# EAGLE design spi_node (EAGLE 9.6.2)
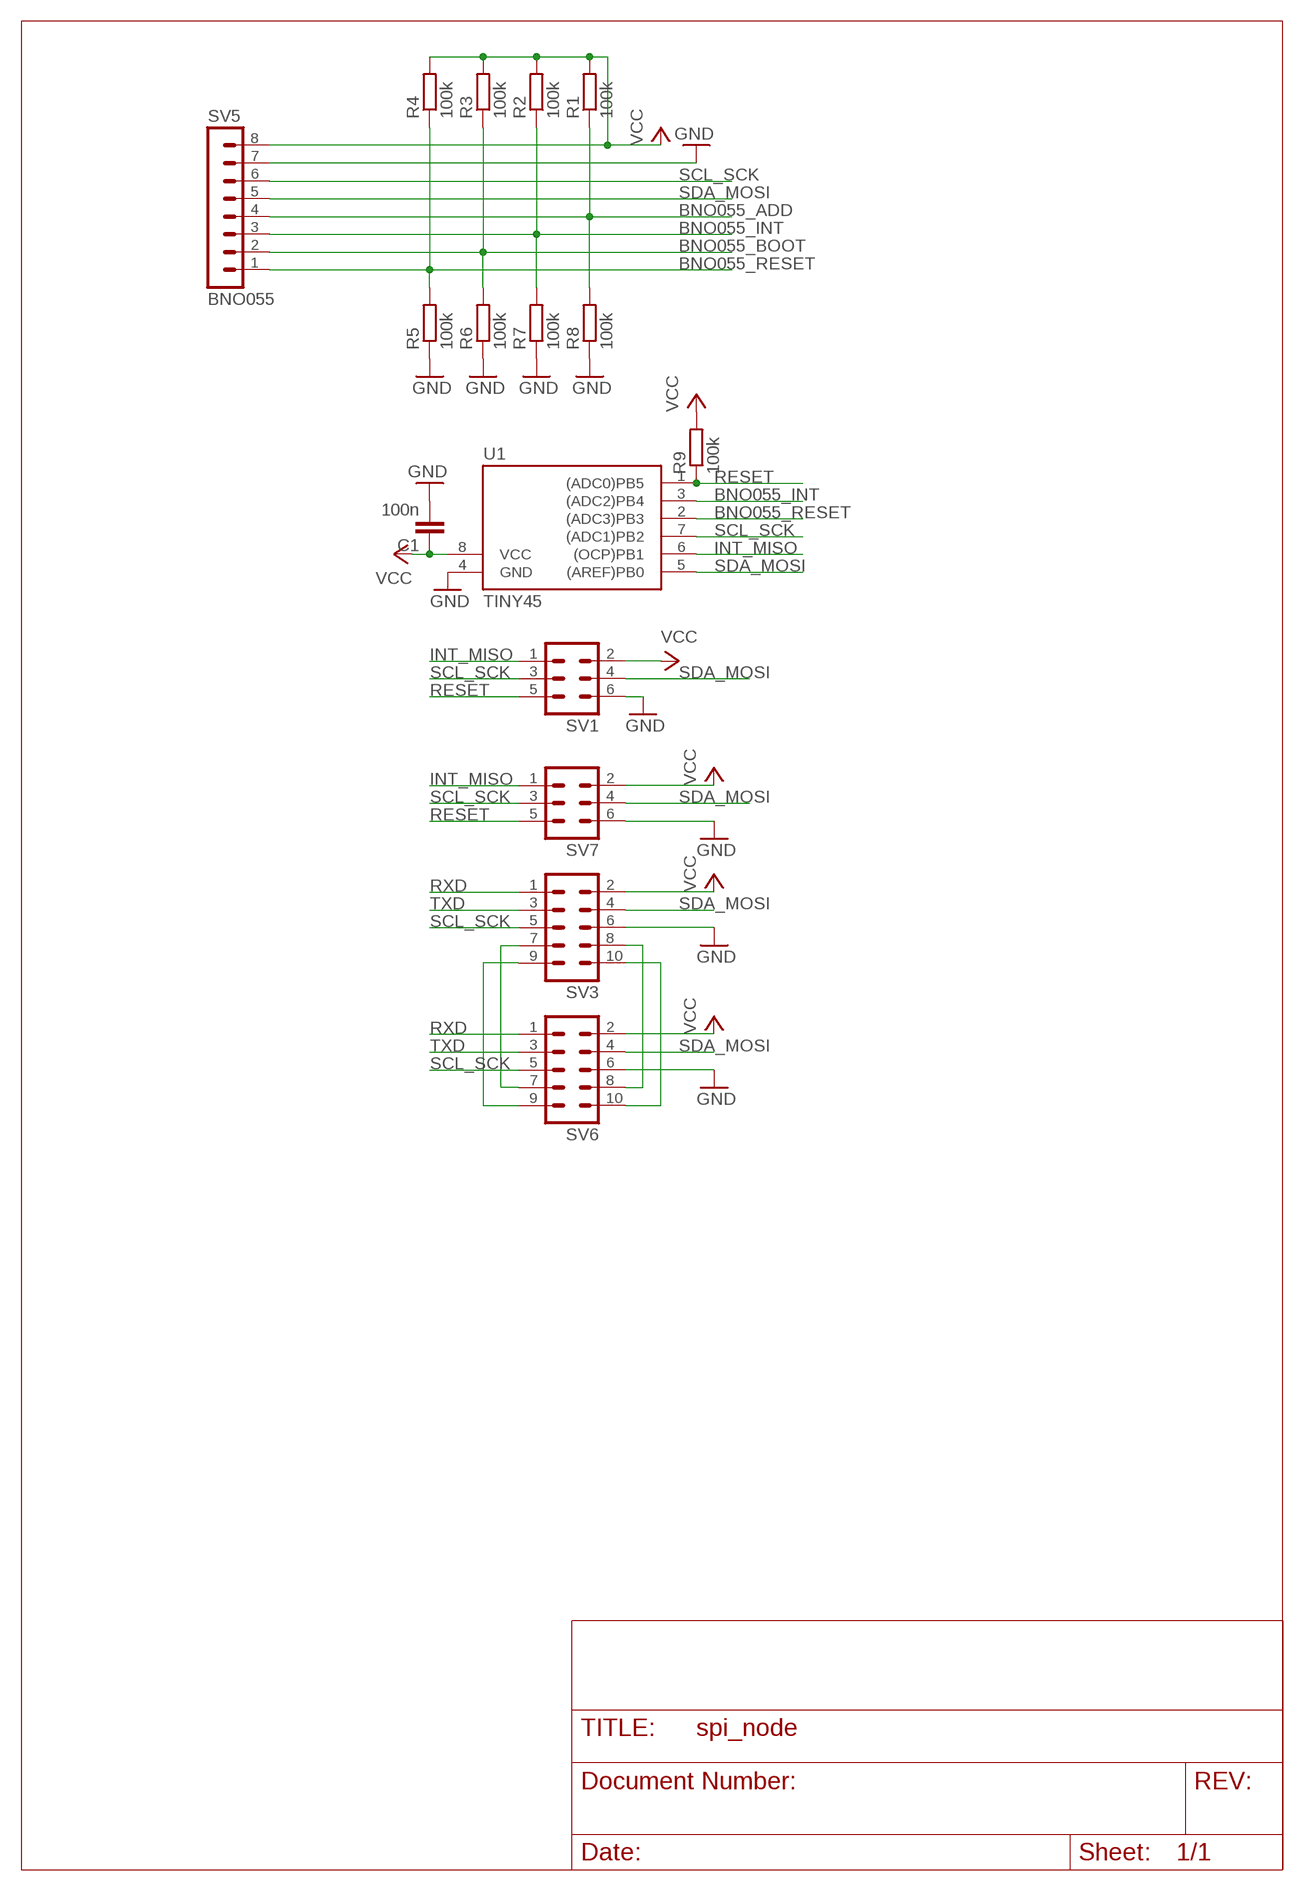
[diagram p0: schematic, sheet 1]

## Parts
C1  100n  C-EUC0805  [C0805]
R1  100k  R-EU_M0805  [M0805]
R2  100k  R-EU_M0805  [M0805]
R3  100k  R-EU_M0805  [M0805]
R4  100k  R-EU_M0805  [M0805]
R5  100k  R-EU_M0805  [M0805]
R6  100k  R-EU_M0805  [M0805]
R7  100k  R-EU_M0805  [M0805]
R8  100k  R-EU_M0805  [M0805]
R9  100k  R-EU_M0805  [M0805]
SV1  ML6  [ML6]
SV3  ML10  [ML10]
SV5  BNO055  MA08-1  [MA08-1]
SV6  ML10  [ML10]
SV7  ML6  [ML6]
U1  TINY45  TINY25/45/85-20SU  [SOIC8]

## Nets
BNO055_ADD: R1.1 R8.2 SV5.4
BNO055_BOOT: R3.1 R6.2 SV5.2
BNO055_INT: R2.1 R7.2 SV5.3 U1.3((ADC2)PB4)
BNO055_RESET: R4.1 R5.2 SV5.1 U1.2((ADC3)PB3)
GND: C1.2 R5.1 R6.1 R7.1 R8.1 SV1.6 SV3.6 SV5.7 SV6.6 SV7.6 U1.4(GND)
INT_MISO: SV1.1 SV7.1 U1.6((OCP)PB1)
N$1: SV3.7 SV6.7
N$2: SV3.9 SV6.9
N$3: SV3.8 SV6.8
N$4: SV3.10 SV6.10
RESET: R9.1 SV1.5 SV7.5 U1.1((ADC0)PB5)
RXD: SV3.1 SV6.1
SCL_SCK: SV1.3 SV3.5 SV5.6 SV6.5 SV7.3 U1.7((ADC1)PB2)
SDA_MOSI: SV1.4 SV3.4 SV5.5 SV6.4 SV7.4 U1.5((AREF)PB0)
TXD: SV3.3 SV6.3
VCC: C1.1 R1.2 R2.2 R3.2 R4.2 R9.2 SV1.2 SV3.2 SV5.8 SV6.2 SV7.2 U1.8(VCC)

## Library data of the parts
C1 = rcl:C-EU: CAPACITOR, European symbol
R1-R9 = rcl:R-EU_: RESISTOR, European symbol
SV1 SV7 = con-harting-ml:ML6: HARTING; OC_FARNELL: unknown; OC_NEWARK: unknown
SV3 SV6 = con-harting-ml:ML10: HARTING; OC_FARNELL: unknown; OC_NEWARK: unknown
SV5 = con-lstb:MA08-1: PIN HEADER; OC_FARNELL: unknown; OC_NEWARK: unknown
U1 = avr-7:TINY25/45/85

## Board
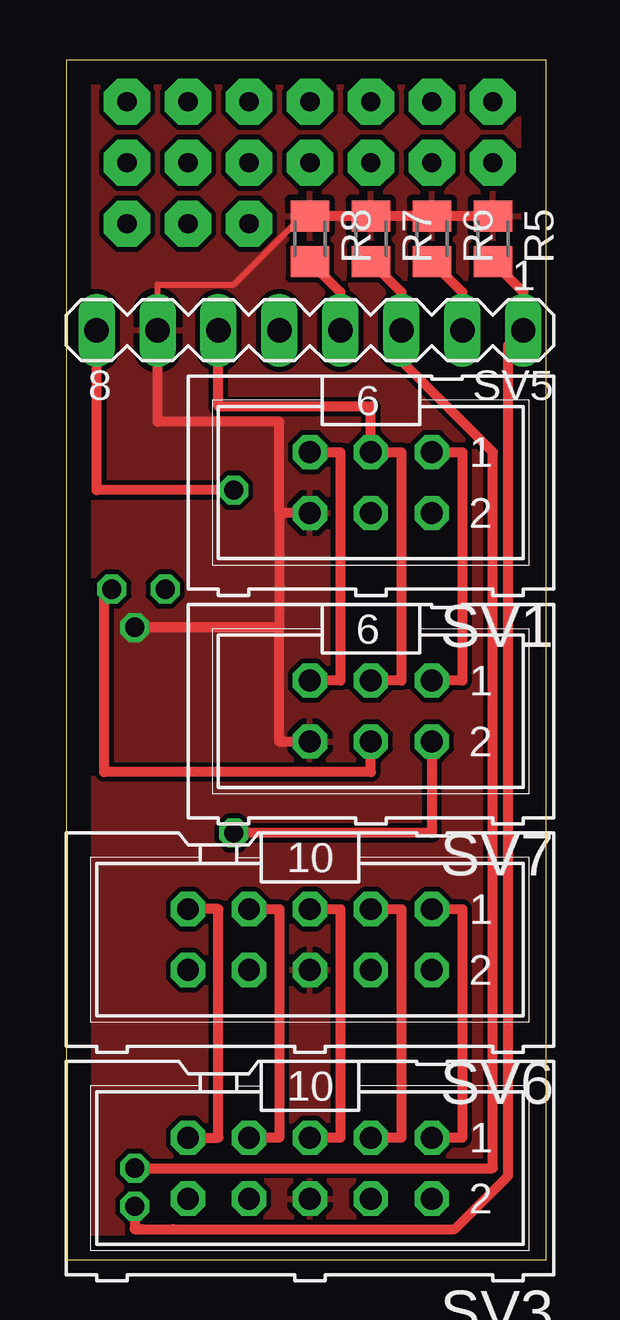
[diagram p1: board, top side]
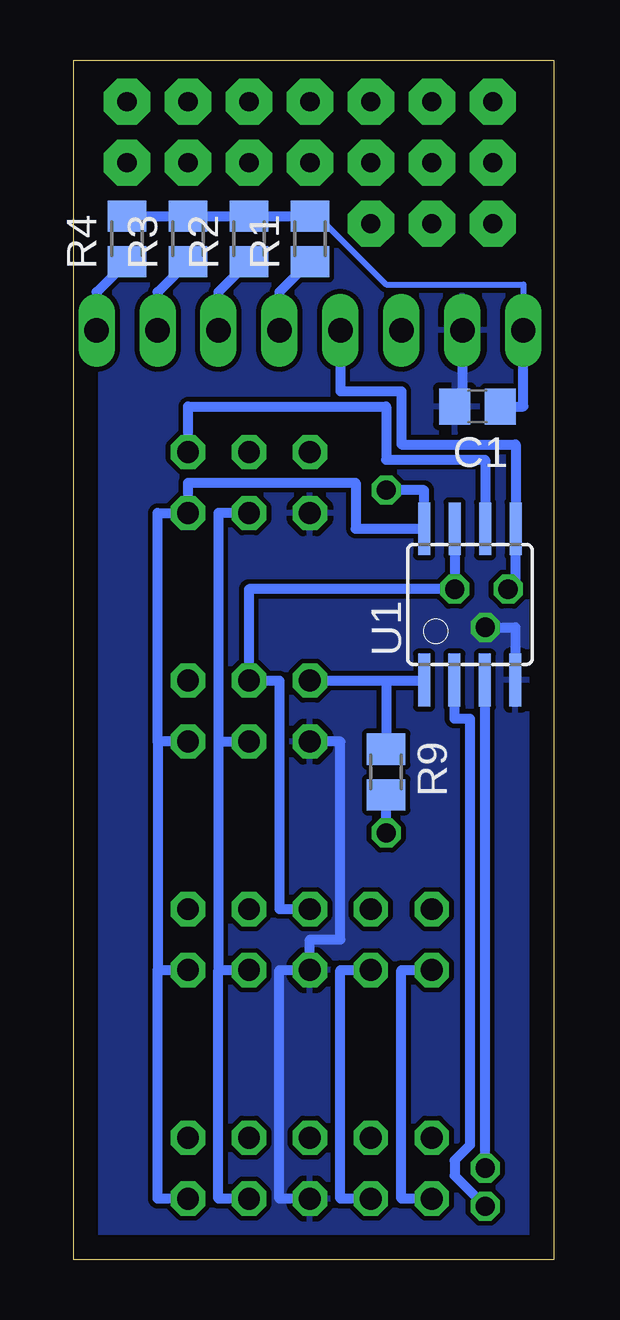
[diagram p2: board, bottom side, seen from below]

Size 20 x 50 mm. Coordinates in mm from the lower left corner, seen from the top.
Outline: 0,0 20,0 20,50 0,50 0,0
Copper layers (1*16): Top 0.035mm / dielectric 1.5mm / Bottom 0.035mm
Design rules "default": minimum track width 10mil, minimum drill 24mil, track to track 8mil, track to pad 8mil, pad to pad 8mil, via to via 8mil, smd to smd 8mil, copper to edge 40mil, drill to drill 8mil, minimum pad ring 10mil, minimum via ring 8mil, stop-mask expansion 4mil, vias tented up to drill 0mil, thermal gap 10mil

### Footprints (pad centres in the part's own frame; a part is rotated, then mirrored left to right if it is on the bottom)
C0805 = smd 1.3 x 1.5: 1 -0.95,0; 2 0.95,0
M0805 = smd 1.3 x 1.6: 1 -0.95,0; 2 0.95,0
ML6 = drill 0.914 octagon: 1 -2.54,-1.27; 2 -2.54,1.27; 3 0,-1.27; 4 0,1.27; 5 2.54,-1.27; 6 2.54,1.27
ML10 = drill 0.914 octagon: 1 -5.08,-1.27; 2 -5.08,1.27; 3 -2.54,-1.27; 4 -2.54,1.27; 5 0,-1.27; 6 0,1.27; 7 2.54,-1.27; 8 2.54,1.27; 9 5.08,-1.27; 10 5.08,1.27
MA08-1 = drill 1.016 long: 1 -8.89,0; 2 -6.35,0; 3 -3.81,0; 4 -1.27,0; 5 1.27,0; 6 3.81,0; 7 6.35,0; 8 8.89,0
SOIC8 = smd 0.5 x 2.2: 1 -1.905,-3.154; 2 -0.645,-3.154; 3 0.625,-3.154; 4 1.895,-3.154; 5 1.905,3.154; 6 0.635,3.154; 7 -0.635,3.154; 8 -1.905,3.154

### Placement (x,y rotation side)
C1  3.17,35.56 180 bottom
R1  10.16,42.55 90 bottom
R2  12.7,42.55 90 bottom
R3  15.24,42.55 90 bottom
R4  17.78,42.55 90 bottom
R5  17.78,42.55 270 top
R6  15.24,42.55 270 top
R7  12.7,42.55 270 top
R8  10.16,42.55 270 top
R9  6.99,20.32 270 bottom
SV1  12.7,32.38 180 top
SV3  10.16,3.81 180 top
SV5  10.16,38.73 180 top
SV6  10.16,13.34 180 top
SV7  12.7,22.86 180 top
U1  3.49,27.3 0 bottom

### Tracks (layer width: path | path; a pad name or v marks a point on that pad's centre or on a via)
BNO055_ADD
  Top 0.406: SV5.4 11.43,40.33 R8.2
  Bottom 0.406: R8.2 11.43,40.33 SV5.4
BNO055_BOOT
  Top 0.406: SV5.2 16.51,40.33 R6.2
  Bottom 0.406: R6.2 16.51,40.33 SV5.2
BNO055_INT  (via drill 0.8 pad 0.25)
  Top 0.406: R7.2 13.97,40.33 SV5.3 13.97,37.47 17.78,33.66 17.78,3.81 v2.86,3.81
  Bottom 0.406: R7.2 13.97,40.33 SV5.3 | U1.3 v2.87,3.81 v2.86,3.81
BNO055_RESET  (via drill 0.8 pad 0.25)
  Top 0.406: R5.2 19.05,40.33 SV5.1 18.41,38.1 18.41,3.49 16.19,1.27 4.45,1.27 3.17,1.27 2.86,1.27 v2.86,2.22
  Bottom 0.406: R5.2 19.05,40.33 SV5.1 | U1.2 4.14,22.54 3.49,22.54 3.49,4.76 4.13,4.13 4.13,3.49 v2.86,2.22
GND  (via drill 0.8 pad 0.25)
  Top 0.254: R8.1 9.84,43.49 6.99,40.64 3.81,40.64 SV5.7
  Top 0.406: SV7.6 8.89,21.59 8.89,26.35 | SV1.6 8.89,31.11 | 8.89,31.11 8.89,26.35 | R5.1 R6.1 R7.1 R8.1 | 8.89,31.11 8.89,34.92 3.81,34.92 SV5.7 | 8.89,26.35 v2.86,26.35
  Bottom 0.406: SV3.6 11.43,2.54 11.43,12.06 SV6.6 10.16,13.34 8.89,13.34 8.89,21.59 SV7.6 | SV5.7 3.81,35.56 C1.2 | v2.86,26.35 1.6,26.35 U1.4
  pour Bottom: 0,0 20,0 20,50 0,50
  pour Top: 0,0 20,0 20,50 0,50
INT_MISO
  Top 0.406: SV1.1 16.51,33.66 16.51,24.13 SV7.1
  Bottom 0.406: SV1.1 15.24,35.56 6.99,35.56 6.99,33.34 2.86,33.34 U1.6
N$1
  Top 0.406: SV6.7 8.89,14.61 8.89,5.08 SV3.7
N$2
  Top 0.406: SV3.9 6.35,5.08 6.35,14.61 SV6.9
N$3
  Bottom 0.406: SV3.8 8.89,2.54 8.89,12.06 SV6.8
N$4
  Bottom 0.406: SV3.10 6.35,2.54 6.35,12.06 SV6.10
N$5  (via drill 0.8 pad 1.93)
  other vias: 17.78,45.72
N$6  (via drill 0.8 pad 1.93)
  other vias: 15.24,45.72
N$7  (via drill 0.8 pad 1.93)
  other vias: 12.7,45.72
N$8  (via drill 0.8 pad 1.93)
  other vias: 10.16,45.72
N$9  (via drill 0.8 pad 1.93)
  other vias: 7.62,45.72
N$10  (via drill 0.8 pad 1.93)
  other vias: 5.08,45.72
N$11  (via drill 0.8 pad 1.93)
  other vias: 2.54,45.72
N$12  (via drill 0.8 pad 1.93)
  other vias: 2.54,43.18
N$13  (via drill 0.8 pad 1.93)
  other vias: 5.08,43.18
N$14  (via drill 0.8 pad 1.93)
  other vias: 7.62,43.18
N$15  (via drill 0.8 pad 1.93)
  other vias: 2.54,48.26
N$16  (via drill 0.8 pad 1.93)
  other vias: 5.08,48.26
N$17  (via drill 0.8 pad 1.93)
  other vias: 7.62,48.26
N$18  (via drill 0.8 pad 1.93)
  other vias: 10.16,48.26
N$19  (via drill 0.8 pad 1.93)
  other vias: 12.7,48.26
N$20  (via drill 0.8 pad 1.93)
  other vias: 15.24,48.26
N$21  (via drill 0.8 pad 1.93)
  other vias: 17.78,48.26
RESET
  Top 0.406: SV1.5 11.43,33.66 11.43,24.13 SV7.5
  Bottom 0.406: SV7.5 6.99,24.13 | 6.99,24.13 R9.1 | 6.99,24.13 5.4,24.13 U1.1
RXD
  Top 0.406: SV6.1 16.51,14.61 16.51,5.08 SV3.1
SCL_SCK  (via drill 0.8 pad 0.81)
  Top 0.406: SV6.5 11.43,14.61 11.43,5.08 SV3.5 | SV7.3 13.97,24.13 13.97,33.66 SV1.3 12.7,35.56 6.35,35.56 SV5.6
  Bottom 0.406: SV6.5 11.43,14.61 11.43,24.13 SV7.3 12.7,27.94 v4.13,27.94 U1.7
SDA_MOSI  (via drill 0.8 pad 0.25)
  Top 0.406: v1.91,27.94 1.59,27.94 1.59,20.32 12.7,20.32 SV7.4
  Bottom 0.406: SV3.4 13.97,2.54 13.97,12.06 | 13.97,12.06 SV6.4 | SV5.5 8.89,36.2 6.35,36.2 6.35,33.97 1.59,33.97 U1.5 1.59,28.26 v1.91,27.94 | SV1.4 13.97,31.11 13.97,21.59 | 13.97,21.59 13.97,12.06 | 13.97,21.59 SV7.4
TXD
  Top 0.406: SV6.3 13.97,14.61 13.97,5.08 SV3.3
VCC  (via drill 0.8 pad 0.25, 0.8 pad 0.81)
  Top 0.406: SV7.2 15.24,17.78 v6.99,17.78 | v6.99,32.07 1.27,32.07 SV5.8
  Bottom 0.254: R1.2 9.84,43.49 6.99,40.64 1.27,40.64 SV5.8
  Bottom 0.406: SV3.2 16.51,2.54 16.51,12.06 | 16.51,12.06 SV6.2 | 16.51,21.59 16.51,31.11 SV1.2 15.24,32.38 8.26,32.38 8.26,30.46 U1.8 5.4,32.07 v6.99,32.07 | SV7.2 16.51,21.59 | 16.51,21.59 16.51,12.06 | v6.99,17.78 R9.2 | R4.2 R3.2 R2.2 R1.2 | SV5.8 1.27,35.56 C1.1 2.54,35.56